# EasyEDA Pro project KeysDock65.eprj, schematic connector
Board Name: connector; Create Date: 2025-10-15; Page Name: main; Project Name: KeysDock65; Schematic Name: connector; Update Date: 2025-10-16; Company: 嘉立创EDA; Page Size: A4; Version: V1.0
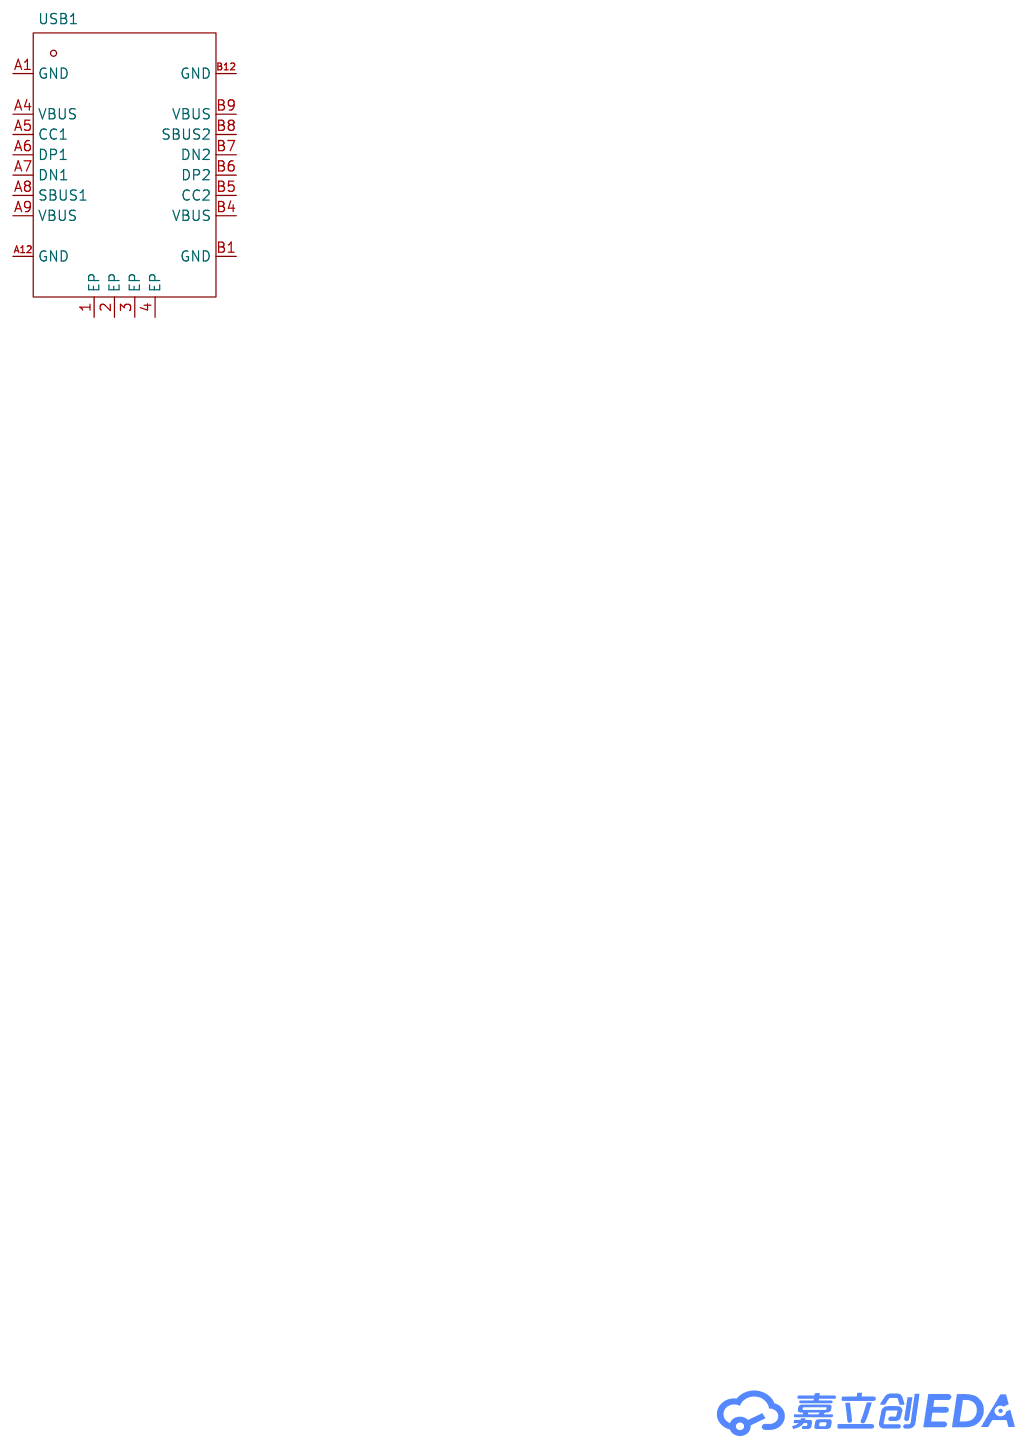
[diagram p3: schematic sheet]

## Parts
USB1  -  [USB_TYPE-C-16P]

## Library data of the parts
USB1 = USB_TYPE-C-16P: Supplier Footprint: SMD

## Nets

Not connected (* = marked no-connect by the designer): USB1 1(EP) 2(EP) 3(EP) 4(EP) A1(GND) A4(VBUS) A5(CC1) A6(DP1) A7(DN1) A8(SBUS1) A9(VBUS) A12(GND) B1(GND) B4(VBUS) B5(CC2) B6(DP2) B7(DN2) B8(SBUS2) B9(VBUS) B12(GND)
